# Altium schematic sheet pca10056_sheet1_cover.SchDoc: =BoardTitle + ' - Cover'
size A3; Organization: Nordic Semiconductor; DocumentNumber: 1; SheetNumber: 1; SheetTotal: 6; CompanyName: Nordic Semiconductor; DocumentSize: A3
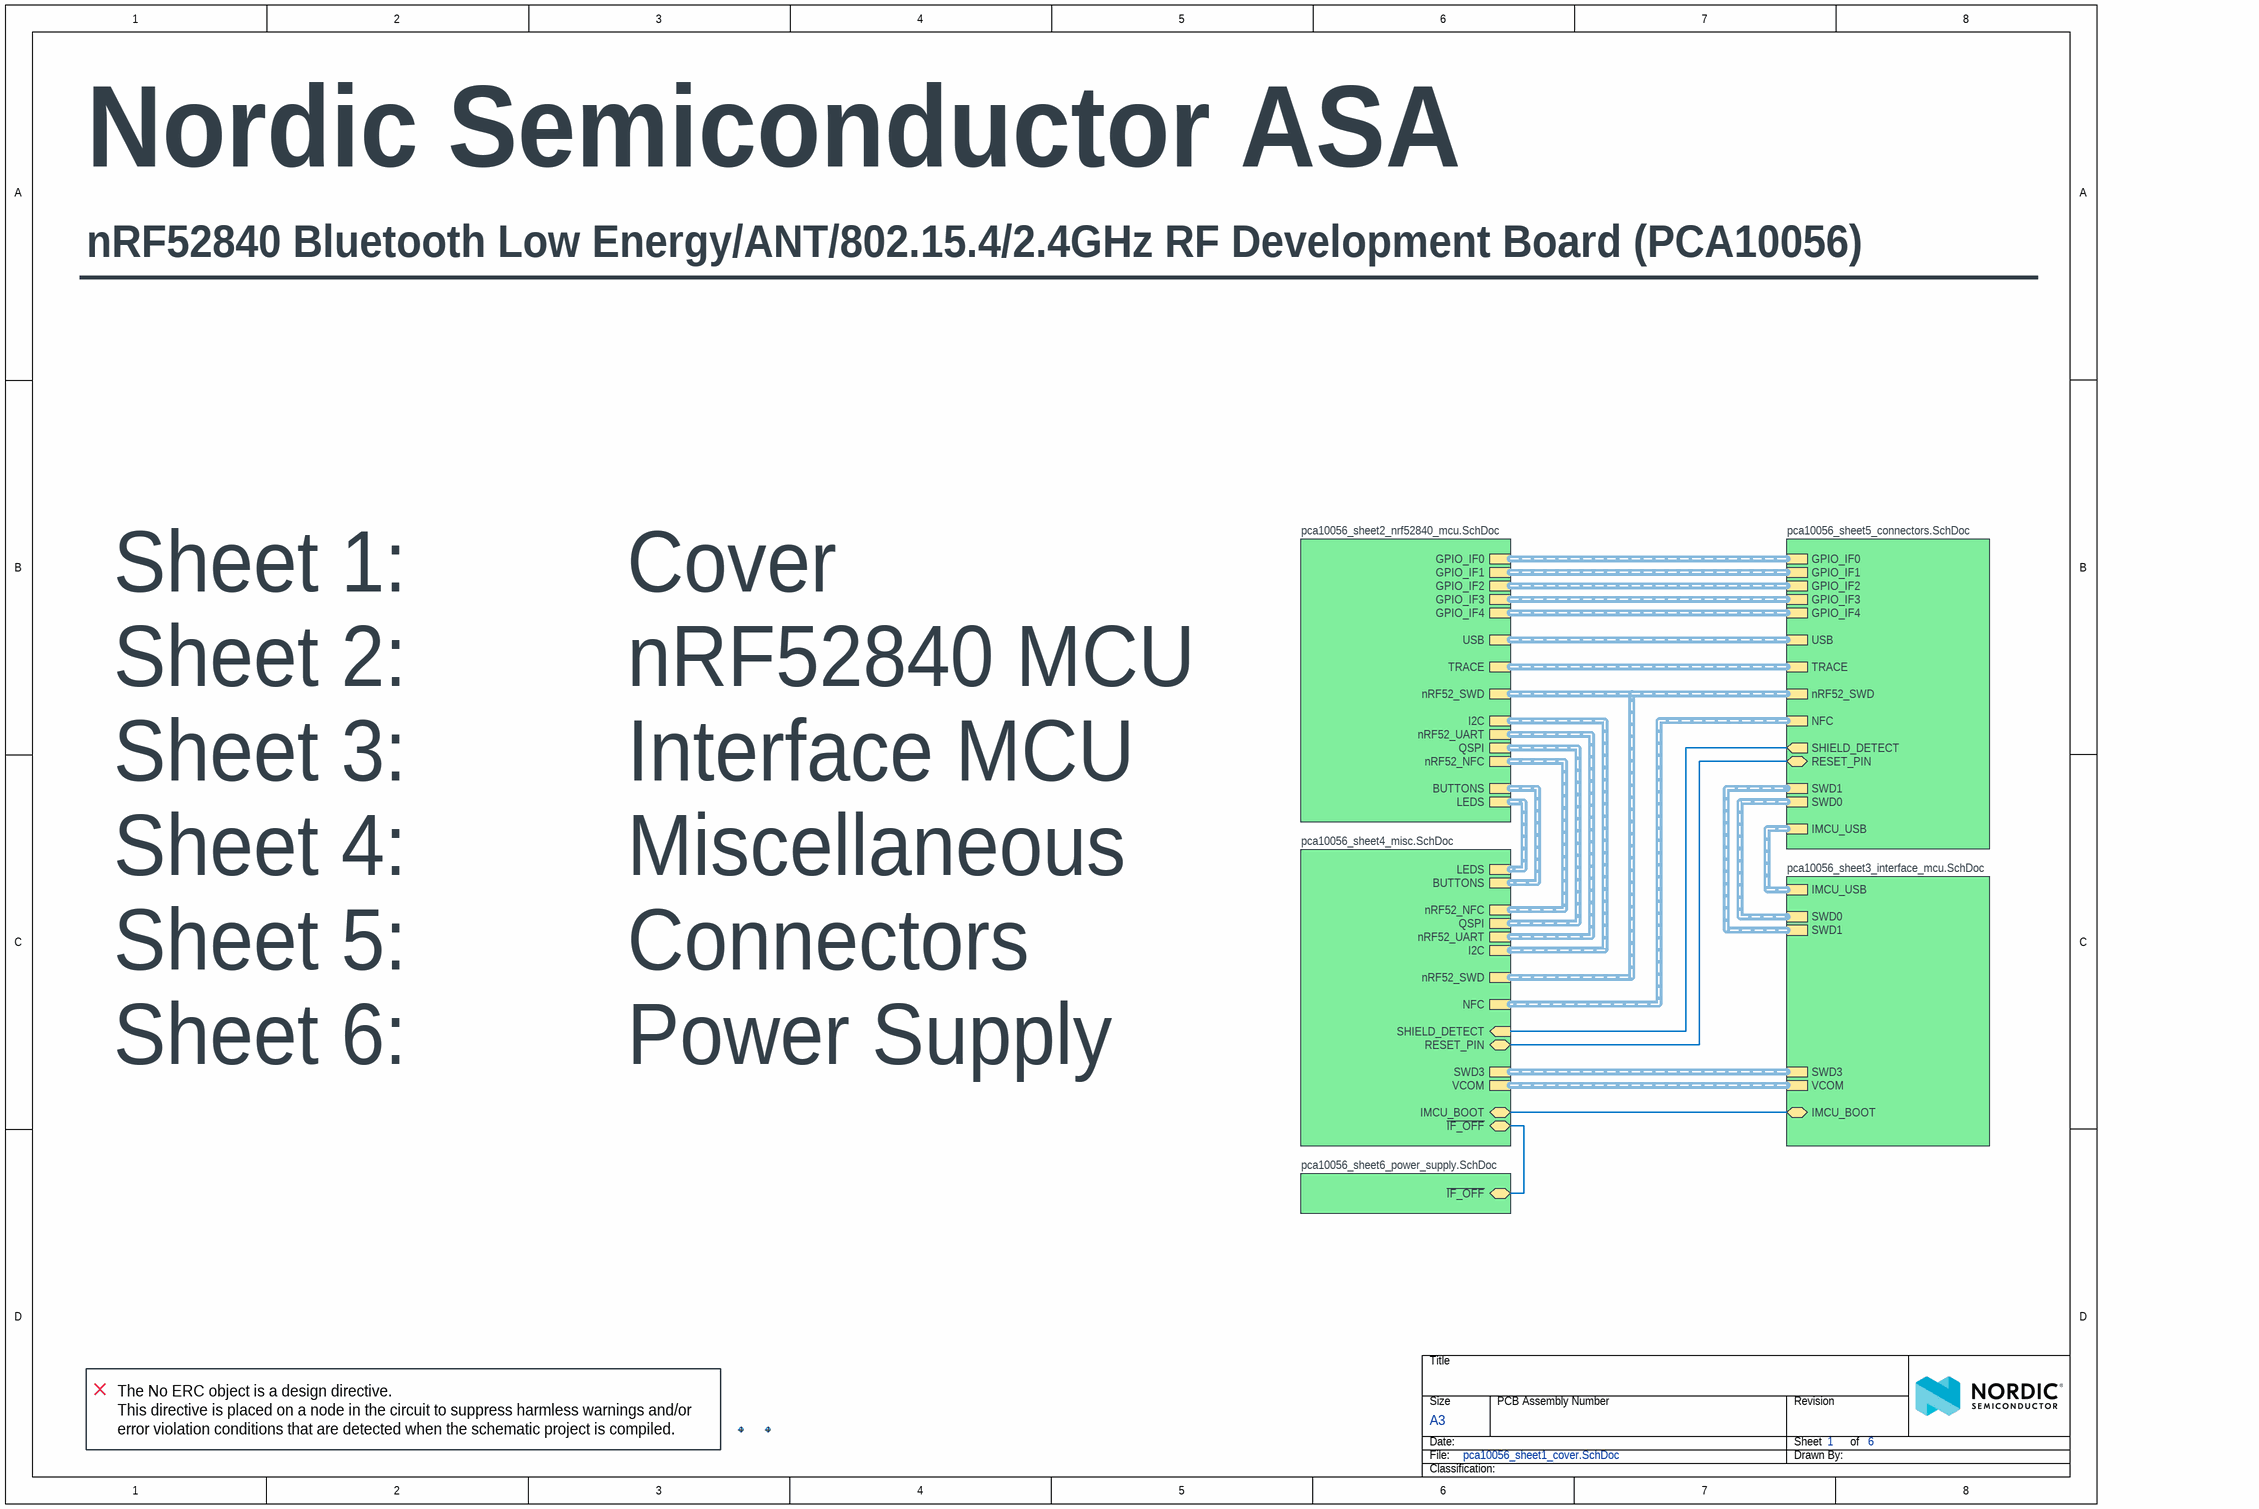
[diagram p0: pca10056_sheet1_cover.SchDoc]

## Parts
Fid1  Fiducial mark  [Fiducial]  (value not drawn)
Fid2  Fiducial mark  [Fiducial]  (value not drawn)

## Sub-sheets
? = pca10056_sheet2_nrf52840_mcu.SchDoc: nRF52_SWD (harness SWD), BUTTONS (harness BUTTONS), GPIO_IF2 (harness GPIO_IF2), GPIO_IF4 (harness GPIO_IF4), I2C (harness I2C), nRF52_UART (harness nRF52_UART), GPIO_IF1 (harness GPIO_IF1), GPIO_IF0 (harness GPIO_IF0), QSPI (harness QSPI), TRACE (harness TRACE), nRF52_NFC (harness NFC), LEDS (harness LED), USB (harness USB), GPIO_IF3 (harness GPIO_IF3)
? = pca10056_sheet3_interface_mcu.SchDoc: SWD0 (harness SWD), IMCU_BOOT (bidir), SWD3 (harness SWD), SWD1 (harness SWD), VCOM (harness UART), IMCU_USB (harness USB)
? = pca10056_sheet4_misc.SchDoc: NFC (harness NFC), QSPI (harness QSPI), SHIELD_DETECT (in), LEDS (harness LED), SWD3 (harness SWD), nRF52_UART (harness nRF52_UART), ~{IF_OFF} (bidir), nRF52_NFC (harness NFC), I2C (harness I2C), BUTTONS (harness BUTTONS), IMCU_BOOT (bidir), RESET_PIN (bidir), nRF52_SWD (harness SWD), VCOM (harness UART)
? = pca10056_sheet5_connectors.SchDoc: SWD0 (harness SWD), SHIELD_DETECT (out), SWD1 (harness SWD), RESET_PIN (bidir), GPIO_IF2 (harness GPIO_IF2), USB (harness USB), GPIO_IF4 (harness GPIO_IF4), nRF52_SWD (harness SWD), GPIO_IF3 (harness GPIO_IF3), TRACE (harness TRACE), GPIO_IF1 (harness GPIO_IF1), GPIO_IF0 (harness GPIO_IF0), IMCU_USB (harness USB), NFC (harness NFC)
? = pca10056_sheet6_power_supply.SchDoc: ~{IF_OFF} (bidir)

## Nets
(unnamed): sheet /IMCU_BOOT, sheet /IMCU_BOOT
(unnamed): sheet /SHIELD_DETECT, sheet /SHIELD_DETECT
(unnamed): sheet /~{IF_OFF}, sheet /~{IF_OFF}
(unnamed): sheet /RESET_PIN, sheet /RESET_PIN

## Notes on the sheet
- Nordic Semiconductor ASA
- ________________________________________________________________
- nRF52840 Bluetooth Low Energy/ANT/802.15.4/2.4GHz RF Development Board (PCA10056)
- Sheet 1:          Cover
- Sheet 2:          nRF52840 MCU
- Sheet 3:          Interface MCU
- Sheet 4:          Miscellaneous
- Sheet 5:          Connectors
- Sheet 6:          Power Supply
- (near Fid1) The No ERC object is a design directive.
  This directive is placed on a node in the circuit to suppress harmless warnings and/or error violation conditions that are detected when the schematic project is compiled.
- Title
- Size
- Date:
- File:
- A3
- PCB Assembly Number
- Sheet         of
- Drawn By:
- Revision
- Classification:

## Library data of the parts
Fid1 Fid2 = Fid-Mark: Manufacturer: N.A.; Part number NEMS: 100500073; Value: N.A.; Pad Count: 1; Component Status: Active; System: Connector; Part Number: Fid-Mark; Manufacturer Part Number: N.A.; LatestRevisionDate: 2009-12-12; Published: 2009-12-12; Note: N.A.; Artikkelnr Noca: N.A.; Footprint Doc: Fiducial; Part number IPS: N.A.; ComponentLink1URL: N.A.; ComponentLink1Description: Datasheet; ComponentLink2URL: N.A.; ComponentLink2Description: Supplier link; HelpURL: N.A.; Supplier 1: N.A.; Supplier Part Number 1: N.A.; Supplier 2: N.A.; Supplier Part Number 2: N.A.; Author: rsk; Component Class: Connectors; PartId: 100500073; Part number Norautron: N.A.